# Altium schematic sheet analog.SchDoc
size A4
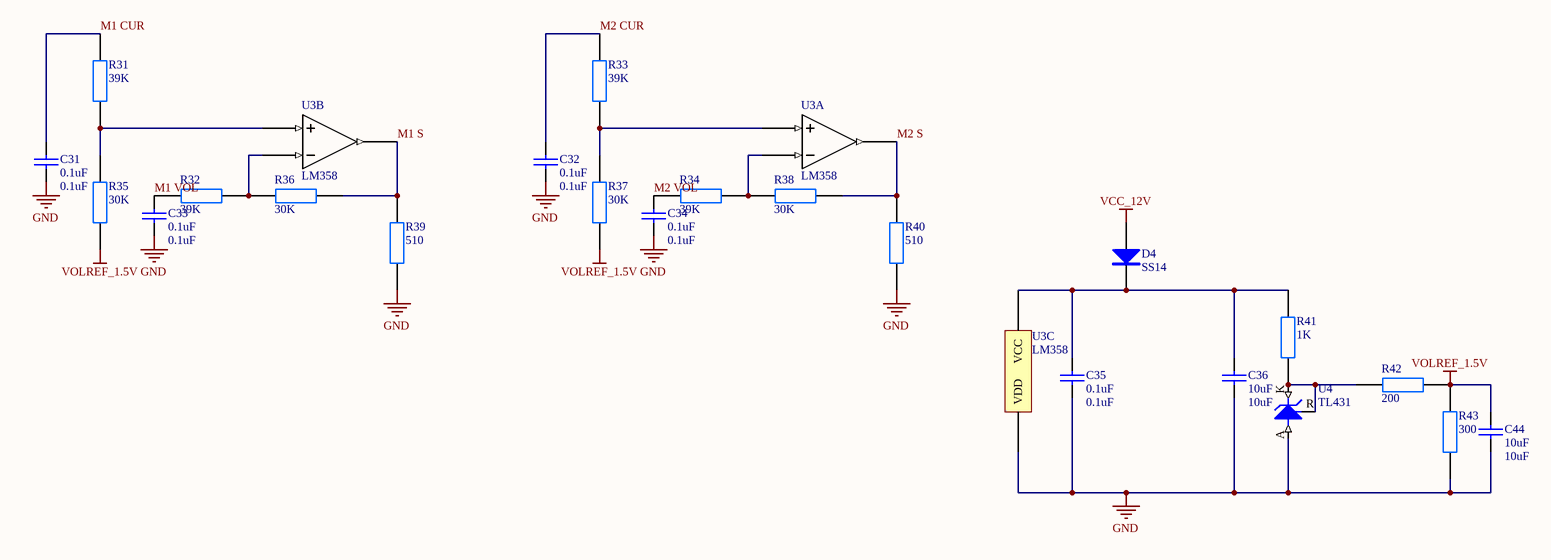
[diagram p0: analog.SchDoc]

## Parts
C31  0.1uF  [0805 CAP]
C32  0.1uF  [0805 CAP]
C33  0.1uF  [0805 CAP]
C34  0.1uF  [0805 CAP]
C35  0.1uF  [0805 CAP]
C36  10uF  [0805 CAP]
C44  10uF  [0805 CAP]
D4  SS14  [SMA]
R31  39K  [0805]
R32  39K  [0805]
R33  39K  [0805]
R34  39K  [0805]
R35  30K  [0805]
R36  30K  [0805]
R37  30K  [0805]
R38  30K  [0805]
R39  510  [0805]
R40  510  [0805]
R41  1K  [0805]
R42  200  [0805]
R43  300  [0805]
U3  LM358  [so-8]  (parts A,B,C of 3)
U4  TL431  [sot-23]

## Nets
GND: C31.2 C32.2 C33.2 C34.2 C35.2 C36.2 C44.2 R39.1 R40.1 R43.1 U3.4(VDD) U4.A
VCC_12V: D4.1(A)
VOLREF_1.5V: C44.1 R35.1 R37.1 R42.1 R43.2
M1 CUR: C31.1 R31.2
M1 S: R36.1 R39.2 U3.7
M1 VOL: C33.1 R32.2
M2 CUR: C32.1 R33.2
M2 S: R38.1 R40.2 U3.1
M2 VOL: C34.1 R34.2
NetC35_1: C35.1 C36.1 D4.2(K) R41.2 U3.8(VCC)
NetR31_1: R31.1 R35.2 U3.5
NetR32_1: R32.1 R36.2 U3.6
NetR33_1: R33.1 R37.2 U3.3
NetR34_1: R34.1 R38.2 U3.2
NetR41_1: R41.1 R42.2 U4.K U4.R

## Library data of the parts
C31-C36 C44 = CAP
  C31-C35: VALUE: 0.1uF
  C36 C44: VALUE: 10uF
D4 = SS14: Diode
R31-R43 = RES
  R31-R34: VALUE: 39K
  R35-R38: VALUE: 30K
  R39 R40: VALUE: 510
  R41: VALUE: 1K
  R42: VALUE: 200
  R43: VALUE: 300
U4 = TL431: IC; pin to pad: A>3 K>2 R>1